# Altium schematic sheet Right_Ref_Sensor_SchDoc.SchDoc
size A4
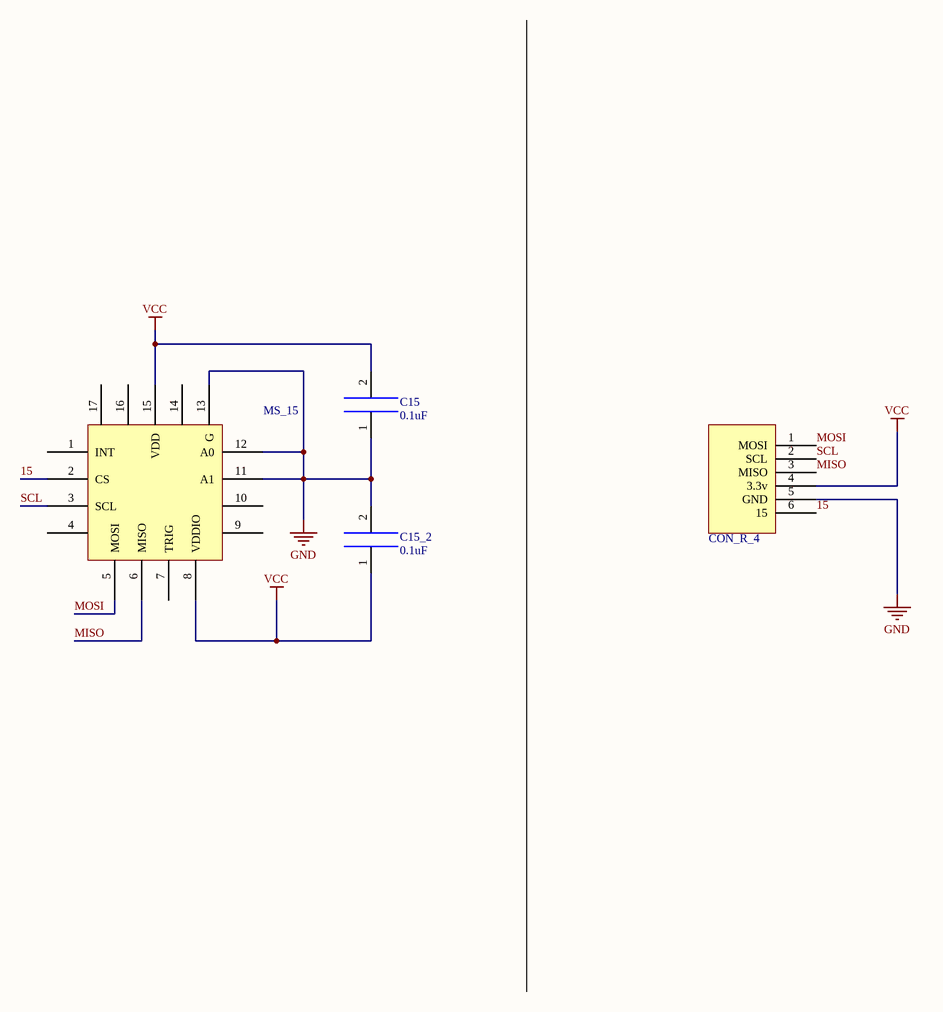
[diagram p0: Right_Ref_Sensor_SchDoc.SchDoc]

## Parts
C15  0.1uF  [CAP_0603]
C15_2  0.1uF  [CAP_0603]
CON_R_4  PIN_right  [PIN_RIGHT_4]  (value not drawn)
MS_15  MLX90393SLW ABA 011 RE  [MLX90393]  (value not drawn)

## Nets
GND: C15.1 C15_2.2 CON_R_4.5(GND) MS_15.11(A1) MS_15.12(A0) MS_15.13(G)
VCC: C15.2 C15_2.1 CON_R_4.4(3.3v) MS_15.8(VDDIO) MS_15.15(VDD)
15: CON_R_4.6(15) MS_15.2(CS)
MISO: CON_R_4.3(MISO) MS_15.6(MISO)
MOSI: CON_R_4.1(MOSI) MS_15.5(MOSI)
SCL: CON_R_4.2(SCL) MS_15.3(SCL)

Not connected (* = marked no-connect by the designer): MS_15 1(INT) 4 7(TRIG) 9 10 14 16 17

## Library data of the parts
C15 C15_2 = CAP: Capacitance
CON_R_4 = PIN_right_4
MS_15 = MLX90393SLW ABA 011 RE: MLX90393 Sensor